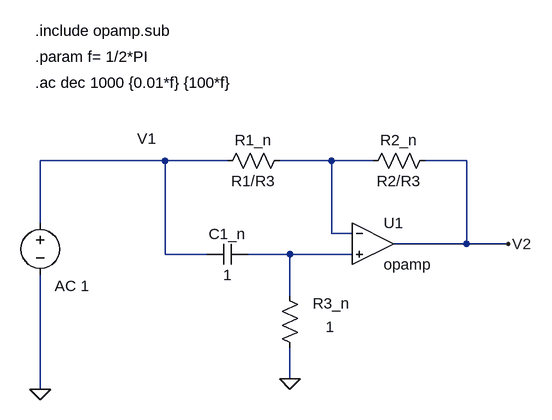
[diagram p0: schematic TS1_LTSpice_norm.asc]
TS1_LTSpice_norm.asc, the LTspice schematic file:
Version 4
SHEET 1 880 680
WIRE -224 -96 -416 -96
WIRE -128 -96 -224 -96
WIRE 32 -96 -48 -96
WIRE 96 -96 32 -96
WIRE 240 -96 176 -96
WIRE -416 0 -416 -96
WIRE 32 16 32 -96
WIRE 64 16 32 16
WIRE 240 32 240 -96
WIRE 240 32 128 32
WIRE 304 32 240 32
WIRE -224 48 -224 -96
WIRE -160 48 -224 48
WIRE -32 48 -96 48
WIRE 64 48 -32 48
WIRE -32 112 -32 48
WIRE -32 240 -32 192
WIRE -416 256 -416 80
FLAG -32 240 0
FLAG -416 256 0
FLAG 304 32 V2
SYMBOL Opamps\\opamp 96 -32 R0
SYMATTR InstName U1
SYMBOL res -32 -112 R90
WINDOW 0 0 56 VBottom 2
WINDOW 3 32 56 VTop 2
SYMATTR InstName R1_n
SYMATTR Value R1/R3
SYMBOL res 192 -112 R90
WINDOW 0 0 56 VBottom 2
WINDOW 3 32 56 VTop 2
SYMATTR InstName R2_n
SYMATTR Value R2/R3
SYMBOL res -16 208 R180
WINDOW 0 -77 84 Left 2
WINDOW 3 -53 48 Left 2
SYMATTR InstName R3_n
SYMATTR Value 1
SYMBOL cap -96 32 R90
WINDOW 0 0 32 VBottom 2
WINDOW 3 32 32 VTop 2
SYMATTR InstName C1_n
SYMATTR Value 1
SYMBOL voltage -416 -16 R0
WINDOW 3 -313 165 Left 2
WINDOW 123 22 113 Left 2
WINDOW 39 0 0 Left 0
WINDOW 0 149 -114 Left 2
SYMATTR Value ""
SYMATTR Value2 AC 1
SYMATTR InstName V1
TEXT -424 -216 Left 2 !.ac dec 1000 {0.01*f} {100*f}
TEXT -424 -296 Left 2 !.include opamp.sub
TEXT -424 -256 Left 2 !.param f= 1/2*PI

The netlist it stands for:
* TS1_LTSpice_norm.asc
XU1 N002 N003 V2 opamp Aol=100K GBW=10Meg  ; pins invin noninvin out
R1_n N002 N001 R1/R3
R2_n V2 N002 R2/R3
R3_n 0 N003 1
C1_n N003 N001 1
V1 N001 0 AC 1
.ac dec 1000 {0.01*f} {100*f}
.include opamp.sub
.param f= 1/2*PI
.backanno
.end